# EAGLE design stm32f4stamp-20131027 (EAGLE 6.4)
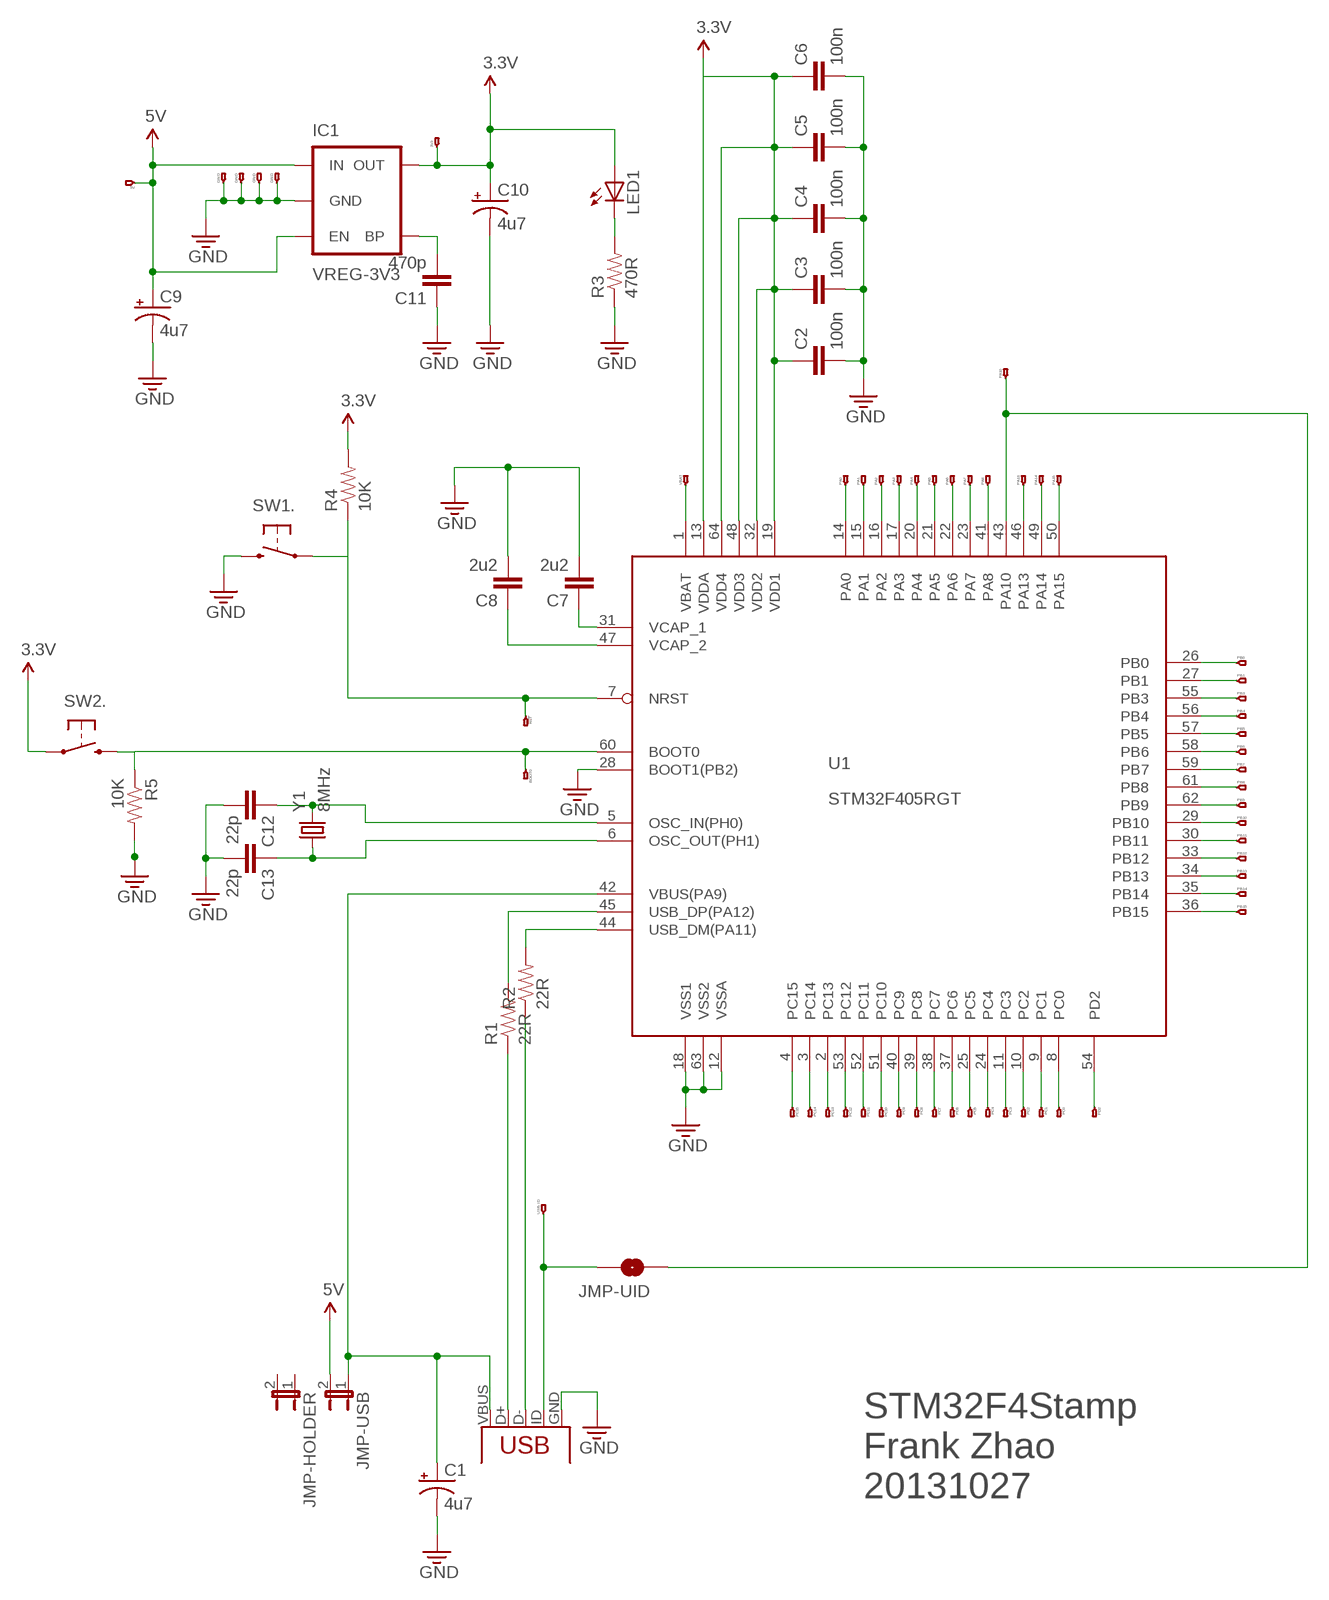
[diagram p0: schematic, sheet 1]

## Parts
C1  4u7  CAP_POL1206-KIT  [EIA3216-KIT]
C2  100n  CAP0603-CAP  [0603-CAP]
C3  100n  CAP0603-CAP  [0603-CAP]
C4  100n  CAP0603-CAP  [0603-CAP]
C5  100n  CAP0603-CAP  [0603-CAP]
C6  100n  CAP0603-CAP  [0603-CAP]
C7  2u2  CAP0603-CAP  [0603-CAP]
C8  2u2  CAP0603-CAP  [0603-CAP]
C9  4u7  CAP_POL1206-KIT  [EIA3216-KIT]
C10  4u7  CAP_POL1206-KIT  [EIA3216-KIT]
C11  470p  CAP0603-CAP  [0603-CAP]
C12  22p  CAP0603-CAP  [0603-CAP]
C13  22p  CAP0603-CAP  [0603-CAP]
IC1  VREG-3V3  V_REG_LDOSMD  [SOT23-5]
JMP-HOLDER  JUMPER-2-PTH-2MM  [1X02_2MM_TH]
JMP-UID  SOLDERJUMPERNC  [SJ_2S]
JMP-USB  JUMPER-2-PTH-2MM  [1X02_2MM_TH]
JP2  5V  HEADERHOLE-HEADERHOLE  [1X1-HEADER-HOLE]
JP3  GND  HEADERHOLE-HEADERHOLE  [1X1-HEADER-HOLE]
JP4  3V3  HEADERHOLE-HEADERHOLE  [1X1-HEADER-HOLE]
JP5  GND  HEADERHOLE-HEADERHOLE  [1X1-HEADER-HOLE]
JP6  GND  HEADERHOLE-HEADERHOLE  [1X1-HEADER-HOLE]
JP7  GND  HEADERHOLE-HEADERHOLE  [1X1-HEADER-HOLE]
JP8  PB8  HEADERHOLE-HEADERHOLE  [1X1-HEADER-HOLE]
JP9  PA10  HEADERHOLE-HEADERHOLE  [1X1-HEADER-HOLE]
JP10  PA8  HEADERHOLE-HEADERHOLE  [1X1-HEADER-HOLE]
JP11  PA13  HEADERHOLE-HEADERHOLE  [1X1-HEADER-HOLE]
JP12  PC9  HEADERHOLE-HEADERHOLE  [1X1-HEADER-HOLE]
JP13  PC15  HEADERHOLE-HEADERHOLE  [1X1-HEADER-HOLE]
JP14  PC14  HEADERHOLE-HEADERHOLE  [1X1-HEADER-HOLE]
JP15  PC13  HEADERHOLE-HEADERHOLE  [1X1-HEADER-HOLE]
JP16  PC12  HEADERHOLE-HEADERHOLE  [1X1-HEADER-HOLE]
JP17  PC11  HEADERHOLE-HEADERHOLE  [1X1-HEADER-HOLE]
JP18  PC10  HEADERHOLE-HEADERHOLE  [1X1-HEADER-HOLE]
JP19  PC8  HEADERHOLE-HEADERHOLE  [1X1-HEADER-HOLE]
JP20  PC7  HEADERHOLE-HEADERHOLE  [1X1-HEADER-HOLE]
JP21  PC6  HEADERHOLE-HEADERHOLE  [1X1-HEADER-HOLE]
JP22  PC5  HEADERHOLE-HEADERHOLE  [1X1-HEADER-HOLE]
JP23  PC4  HEADERHOLE-HEADERHOLE  [1X1-HEADER-HOLE]
JP24  PC3  HEADERHOLE-HEADERHOLE  [1X1-HEADER-HOLE]
JP25  PC2  HEADERHOLE-HEADERHOLE  [1X1-HEADER-HOLE]
JP26  PC1  HEADERHOLE-HEADERHOLE  [1X1-HEADER-HOLE]
JP27  PC0  HEADERHOLE-HEADERHOLE  [1X1-HEADER-HOLE]
JP28  PD2  HEADERHOLE-HEADERHOLE  [1X1-HEADER-HOLE]
JP29  PA0  HEADERHOLE-HEADERHOLE  [1X1-HEADER-HOLE]
JP30  PA1  HEADERHOLE-HEADERHOLE  [1X1-HEADER-HOLE]
JP31  PA2  HEADERHOLE-HEADERHOLE  [1X1-HEADER-HOLE]
JP32  PA3  HEADERHOLE-HEADERHOLE  [1X1-HEADER-HOLE]
JP33  PA4  HEADERHOLE-HEADERHOLE  [1X1-HEADER-HOLE]
JP34  PA5  HEADERHOLE-HEADERHOLE  [1X1-HEADER-HOLE]
JP35  PA6  HEADERHOLE-HEADERHOLE  [1X1-HEADER-HOLE]
JP36  PA7  HEADERHOLE-HEADERHOLE  [1X1-HEADER-HOLE]
JP37  PA14  HEADERHOLE-HEADERHOLE  [1X1-HEADER-HOLE]
JP38  PA15  HEADERHOLE-HEADERHOLE  [1X1-HEADER-HOLE]
JP39  PB0  HEADERHOLE-HEADERHOLE  [1X1-HEADER-HOLE]
JP40  PB1  HEADERHOLE-HEADERHOLE  [1X1-HEADER-HOLE]
JP41  PB3  HEADERHOLE-HEADERHOLE  [1X1-HEADER-HOLE]
JP42  PB4  HEADERHOLE-HEADERHOLE  [1X1-HEADER-HOLE]
JP43  PB5  HEADERHOLE-HEADERHOLE  [1X1-HEADER-HOLE]
JP44  PB6  HEADERHOLE-HEADERHOLE  [1X1-HEADER-HOLE]
JP45  PB7  HEADERHOLE-HEADERHOLE  [1X1-HEADER-HOLE]
JP46  PB9  HEADERHOLE-HEADERHOLE  [1X1-HEADER-HOLE]
JP47  PB10  HEADERHOLE-HEADERHOLE  [1X1-HEADER-HOLE]
JP48  PB11  HEADERHOLE-HEADERHOLE  [1X1-HEADER-HOLE]
JP49  PB12  HEADERHOLE-HEADERHOLE  [1X1-HEADER-HOLE]
JP50  PB13  HEADERHOLE-HEADERHOLE  [1X1-HEADER-HOLE]
JP51  PB14  HEADERHOLE-HEADERHOLE  [1X1-HEADER-HOLE]
JP52  PB15  HEADERHOLE-HEADERHOLE  [1X1-HEADER-HOLE]
JP53  VBAT  HEADERHOLE-HEADERHOLE  [1X1-HEADER-HOLE]
JP54  !RST  HEADERHOLE-HEADERHOLE  [1X1-HEADER-HOLE]
JP55  BOOT0  HEADERHOLE-HEADERHOLE  [1X1-HEADER-HOLE]
JP56  USB-ID  HEADERHOLE-HEADERHOLE  [1X1-HEADER-HOLE]
LED1  LED0603  [LED-0603]
R1  22R  RESISTOR0603-RES  [0603-RES]
R2  22R  RESISTOR0603-RES  [0603-RES]
R3  470R  RESISTOR0603-RES  [0603-RES]
R4  10K  RESISTOR0603-RES  [0603-RES]
R5  10K  RESISTOR0603-RES  [0603-RES]
SW1  !RST  SWITCH-B3U-1110-BOSS  [SWITCH-TACT-B3U-1100P-B]
SW2  BOOT  SWITCH-B3U-1110-BOSS  [SWITCH-TACT-B3U-1100P-B]
U1  STM32F405RGT  [LQFP64]
USB  USB-MICROB-SMD  [USB-MICROB-SMD]
Y1  8MHz  CRYSTAL5X3  [CRYSTAL-SMD-5X3]

## Nets
3.3V: C2.1 C3.1 C4.1 C5.1 C6.1 C10.A(+) IC1.5(OUT) JP4.1 LED1.A R4.2 SW2.1 U1.13(VDDA) U1.19(VDD1) U1.32(VDD2) U1.48(VDD3) U1.64(VDD4)
5V: C9.A(+) IC1.1(IN) IC1.3(EN) JMP-USB.2 JP2.1
GND: C1.C(-) C2.2 C3.2 C4.2 C5.2 C6.2 C7.2 C8.2 C9.C(-) C10.C(-) C11.1 C12.2 C13.2 IC1.2(GND) JP3.1 JP5.1 JP6.1 JP7.1 R3.1 R5.2 SW1.2 SW1.BOSS SW2.BOSS U1.12(VSSA) U1.18(VSS1) U1.28(BOOT1(PB2)) U1.63(VSS2) USB.GND USB.MT1 USB.MT2 USB.MT3 USB.MT4
N$1: R1.2 U1.45(USB_DP(PA12))
N$2: R2.2 U1.44(USB_DM(PA11))
N$3: C1.A(+) JMP-USB.1 U1.42(VBUS(PA9)) USB.VBUS
N$4: JP12.1 U1.40(PC9)
N$5: R1.1 USB.D+
N$6: R2.1 USB.D-
N$7: JP8.1 U1.61(PB8)
N$8: C11.2 IC1.4(BP)
N$10: JP10.1 U1.41(PA8)
N$11: JP11.1 U1.46(PA13)
N$12: C13.1 U1.6(OSC_OUT(PH1)) Y1.1
N$13: C7.1 U1.31(VCAP_1)
N$14: C8.1 U1.47(VCAP_2)
N$15: C12.1 U1.5(OSC_IN(PH0)) Y1.3
N$16: JP55.1 R5.1 SW2.2 U1.60(BOOT0)
N$17: JP54.1 R4.1 SW1.1 U1.7(NRST)
N$18: LED1.C R3.2
N$20: JMP-UID.2 JP56.1 USB.ID
N$22: JMP-UID.1 JP9.1 U1.43(PA10)
N$23: JP13.1 U1.4(PC15)
N$24: JP14.1 U1.3(PC14)
N$25: JP15.1 U1.2(PC13)
N$26: JP16.1 U1.53(PC12)
N$27: JP17.1 U1.52(PC11)
N$28: JP18.1 U1.51(PC10)
N$29: JP19.1 U1.39(PC8)
N$30: JP20.1 U1.38(PC7)
N$31: JP21.1 U1.37(PC6)
N$32: JP22.1 U1.25(PC5)
N$33: JP23.1 U1.24(PC4)
N$34: JP24.1 U1.11(PC3)
N$35: JP25.1 U1.10(PC2)
N$36: JP26.1 U1.9(PC1)
N$37: JP27.1 U1.8(PC0)
N$38: JP28.1 U1.54(PD2)
N$39: JP29.1 U1.14(PA0)
N$40: JP30.1 U1.15(PA1)
N$41: JP31.1 U1.16(PA2)
N$42: JP32.1 U1.17(PA3)
N$43: JP33.1 U1.20(PA4)
N$44: JP34.1 U1.21(PA5)
N$45: JP35.1 U1.22(PA6)
N$46: JP36.1 U1.23(PA7)
N$47: JP37.1 U1.49(PA14)
N$48: JP38.1 U1.50(PA15)
N$49: JP39.1 U1.26(PB0)
N$50: JP40.1 U1.27(PB1)
N$51: JP41.1 U1.55(PB3)
N$52: JP42.1 U1.56(PB4)
N$53: JP43.1 U1.57(PB5)
N$54: JP44.1 U1.58(PB6)
N$55: JP45.1 U1.59(PB7)
N$56: JP46.1 U1.62(PB9)
N$57: JP47.1 U1.29(PB10)
N$58: JP48.1 U1.30(PB11)
N$59: JP49.1 U1.33(PB12)
N$60: JP50.1 U1.34(PB13)
N$61: JP51.1 U1.35(PB14)
N$62: JP52.1 U1.36(PB15)
N$63: JP53.1 U1.1(VBAT)
Unconnected: JMP-HOLDER.1 JMP-HOLDER.2

## Notes on the sheet
- STM32F4Stamp
  Frank Zhao
  20131027

## Library data of the parts
C1 C9 C10 = stm32f4stamp:CAP_POL: Capacitor Polarized These are standard SMD and PTH capacitors. Normally 10uF, 47uF, and 100uF in electrolytic and tantalum varieties. Always verify the external diameter of the through hole cap, it varies with capacity, voltage, and manufacturer. The EIA devices should be standard.
C2-C8 C11-C13 = stm32f4stamp:CAP: Capacitor Standard 0603 ceramic capacitor, and 0.1" leaded capacitor.
IC1 = stm32f4stamp:V_REG_LDO: Voltage Regulator LDO Standard 150mA LDO voltage regulator in SOT-23 layout. Micrel part MIC5205. BP (by-pass) pin is used to lower output noise with 470pF cap.
JMP-HOLDER JMP-USB = stm32f4stamp:JUMPER-2: Jumper Basic 0.1" spaced jumper. Use with breakaway headers.
JMP-UID = stm32f4stamp:SOLDERJUMPER: Solder Jumper Standard SMD solder jumper. Used to automate production. Two varients : Normally Open and Normally Closed are the same, but have different paste layers. NC will have a large amount of paste and should jumper during reflow.
JP2-JP56 = stm32f4stamp:HEADERHOLE
LED1 = stm32f4stamp:LED: LEDs Standard schematic elements and footprints for 5mm, 3mm, 1206, and 0603 sized LEDs. 5mm - Spark Fun Electronics SKU : COM-00529 (and others)
R1-R5 = stm32f4stamp:RESISTOR: Resistor Basic schematic elements and footprints for 0603, 1206, and PTH resistors.
SW1 SW2 = stm32f4stamp:SWITCH-B3U-1110
U1 = stm32f4stamp:STM32F405RGT
USB = stm32f4stamp:USB: USB Connectors USB-B-PTH is fully proven SKU : PRT-00139 USB-miniB is fully proven SKU : PRT-00587 USB-A-PCB is untested. USB-A-H is throughly reviewed, but untested. Spark Fun Electronics SKU : PRT-00437 USB-B-SMT is throughly reviewed, but untested. Needs silkscreen touching up. USB-A-S has not been used/tested USB-MB-H has not been used/tested
Y1 = stm32f4stamp:CRYSTAL: Crystals Various standard crystals. Proven footprints. Spark Fun Electronics SKU : COM-00534

## Board
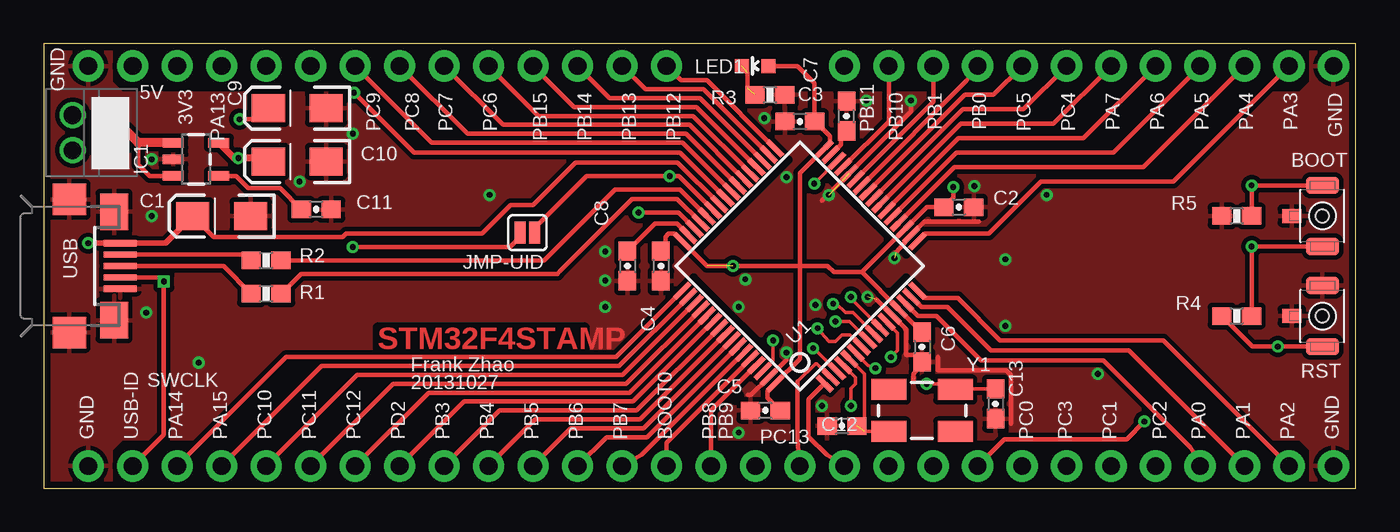
[diagram p1: board, top side]
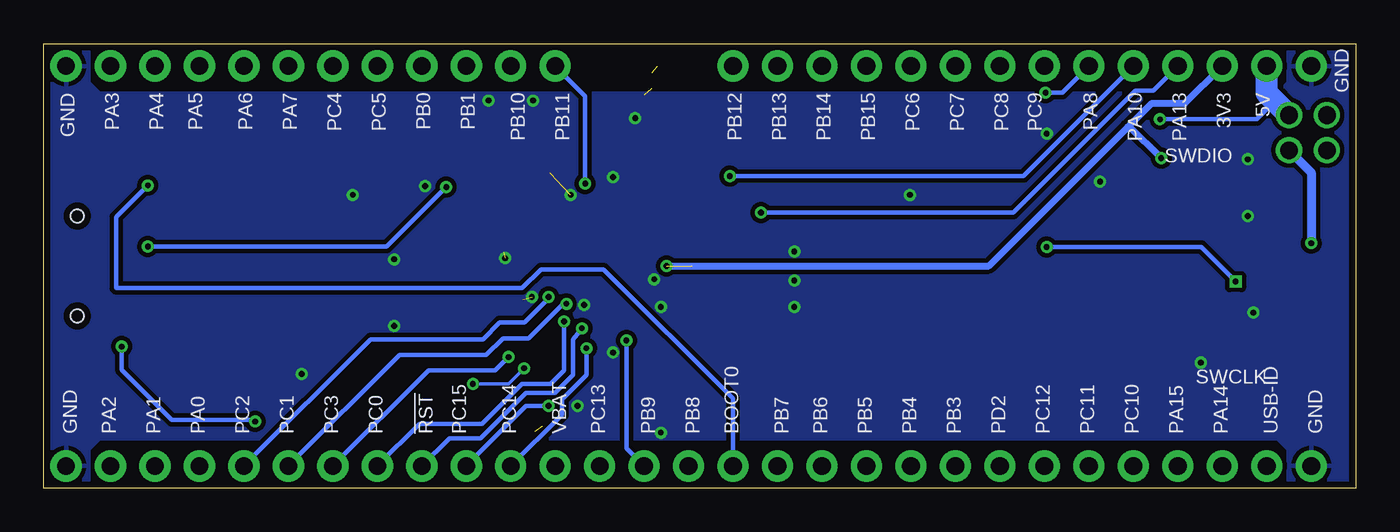
[diagram p2: board, bottom side, seen from below]

Size 74.93 x 25.4 mm. Coordinates in mm from the lower left corner, seen from the top.
Outline: 0,0 74.93,0 74.93,25.4 0,25.4 0,0
Copper layers (1*16): Top 0.0356mm / dielectric 1.5011mm / Bottom 0.0356mm
Design rules "default": minimum track width 6mil, minimum drill 13mil, track to track 6mil, track to pad 6mil, pad to pad 6mil, via to via 6mil, smd to smd 6mil, copper to edge 15mil, drill to drill 6mil, minimum pad ring 7mil, minimum via ring 7mil, stop-mask expansion 2mil, vias tented up to drill 25mil, thermal gap 10mil
tRestrict: 2 lines

### Footprints (pad centres in the part's own frame; a part is rotated, then mirrored left to right if it is on the bottom)
EIA3216-KIT = smd 1.9 x 1.6: A 1.65,0; C -1.65,0
0603-CAP = smd 1.1 x 1: 1 -0.85,0; 2 0.85,0
SOT23-5 = smd 0.55 x 1.2: 1 -0.95,-1.3; 2 0,-1.3; 3 0.95,-1.3; 4 0.95,1.3; 5 -0.95,1.3
1X02_2MM_TH = drill 1: 1 -1,0; 2 1,0
SJ_2S = smd 0.635 x 1.27: 1 -0.412,0; 2 0.412,0
1X1-HEADER-HOLE = drill 1.016 pad 1.778: 1 0,0
LED-0603 = smd 0.8 x 0.8: A 0,-0.75; C 0,0.75
0603-RES = smd 1.1 x 1: 1 -0.85,0; 2 0.85,0
SWITCH-TACT-B3U-1100P-B = smd 1 x 1.9: 1 -1.75,0; 2 1.75,0 | smd 0.8 x 1.1: BOSS 0,1.75 | hole 0.762: 0,0
LQFP64 = smd 0.3 x 1.2: 1 -3.75,-5.75; 2 -3.25,-5.75; 3 -2.75,-5.75; 4 -2.25,-5.75; 5 -1.75,-5.75; 6 -1.25,-5.75; 7 -0.75,-5.75; 8 -0.25,-5.75; 9 0.25,-5.75; 10 0.75,-5.75; 11 1.25,-5.75; 12 1.75,-5.75; 13 2.25,-5.75; 14 2.75,-5.75; 15 3.25,-5.75; 16 3.75,-5.75; 33 3.75,5.75; 34 3.25,5.75; 35 2.75,5.75; 36 2.25,5.75; 37 1.75,5.75; 38 1.25,5.75; 39 0.75,5.75; 40 0.25,5.75; 41 -0.25,5.75; 42 -0.75,5.75; 43 -1.25,5.75; 44 -1.75,5.75; 45 -2.25,5.75; 46 -2.75,5.75; 47 -3.25,5.75; 48 -3.75,5.75 | smd 1.2 x 0.3: 17 5.75,-3.75; 18 5.75,-3.25; 19 5.75,-2.75; 20 5.75,-2.25; 21 5.75,-1.75; 22 5.75,-1.25; 23 5.75,-0.75; 24 5.75,-0.25; 25 5.75,0.25; 26 5.75,0.75; 27 5.75,1.25; 28 5.75,1.75; 29 5.75,2.25; 30 5.75,2.75; 31 5.75,3.25; 32 5.75,3.75; 49 -5.75,3.75; 50 -5.75,3.25; 51 -5.75,2.75; 52 -5.75,2.25; 53 -5.75,1.75; 54 -5.75,1.25; 55 -5.75,0.75; 56 -5.75,0.25; 57 -5.75,-0.25; 58 -5.75,-0.75; 59 -5.75,-1.25; 60 -5.75,-1.75; 61 -5.75,-2.25; 62 -5.75,-2.75; 63 -5.75,-3.25; 64 -5.75,-3.75
USB-MICROB-SMD = smd 0.35 x 1.9: D+ 0,2.9; D- -0.65,2.9; GND 1.3,2.9; ID 0.65,2.9; VBUS -1.3,2.9 | smd 1.8 x 1.9: MT1 -3.8,0; MT2 3.8,0 | smd 2.1 x 1.6: MT3 -3.1,2.55; MT4 3.1,2.55
CRYSTAL-SMD-5X3 = smd 2 x 1.2: 1 -1.9,-1.2; 2 1.9,-1.2; 3 1.9,1.2; 4 -1.9,1.2

### Placement (x,y rotation side)
C1  10.16,15.56 180 top
C2  52.26,16.07 0 top
C3  43.18,20.95 180 top
C4  35.24,12.7 270 top
C5  41.21,4.45 180 top
C6  50.16,8.06 270 top
C7  45.85,21.27 90 top
C8  33.34,12.7 270 top
C9  14.48,21.72 180 top
C10  14.48,18.67 180 top
C11  15.56,15.94 180 top
C12  45.59,3.56 180 top
C13  54.36,4.83 270 top
IC1  8.7,18.8 270 top
JMP-HOLDER  1.65,20.32 90 top
JMP-UID  27.62,14.61 180 top
JMP-USB  3.81,20.32 90 top
JP2  5.08,24.13 0 top
JP3  2.54,24.13 0 top
JP4  7.62,24.13 0 top
JP5  2.54,1.27 0 top
JP6  73.66,1.27 0 top
JP7  73.66,24.13 0 top
JP8  38.1,1.27 0 top
JP9  12.7,24.13 0 top
JP10  15.24,24.13 0 top
JP11  10.16,24.13 0 top
JP12  17.78,24.13 0 top
JP13  50.8,1.27 0 top
JP14  48.26,1.27 0 top
JP15  43.18,1.27 0 top
JP16  17.78,1.27 0 top
JP17  15.24,1.27 0 top
JP18  12.7,1.27 0 top
JP19  20.32,24.13 0 top
JP20  22.86,24.13 0 top
JP21  25.4,24.13 0 top
JP22  55.88,24.13 0 top
JP23  58.42,24.13 0 top
JP24  58.42,1.27 0 top
JP25  63.5,1.27 0 top
JP26  60.96,1.27 0 top
JP27  55.88,1.27 0 top
JP28  20.32,1.27 0 top
JP29  66.04,1.27 0 top
JP30  68.58,1.27 0 top
JP31  71.12,1.27 0 top
JP32  71.12,24.13 0 top
JP33  68.58,24.13 0 top
JP34  66.04,24.13 0 top
JP35  63.5,24.13 0 top
JP36  60.96,24.13 0 top
JP37  7.62,1.27 0 top
JP38  10.16,1.27 0 top
JP39  53.34,24.13 0 top
JP40  50.8,24.13 0 top
JP41  22.86,1.27 0 top
JP42  25.4,1.27 0 top
JP43  27.94,1.27 0 top
JP44  30.48,1.27 0 top
JP45  33.02,1.27 0 top
JP46  40.64,1.27 270 top
JP47  48.26,24.13 270 top
JP48  45.72,24.13 270 top
JP49  35.56,24.13 270 top
JP50  33.02,24.13 270 top
JP51  30.48,24.13 270 top
JP52  27.94,24.13 270 top
JP53  45.72,1.27 0 top
JP54  53.34,1.27 0 top
JP55  35.56,1.27 0 top
JP56  5.08,1.27 0 top
LED1  40.64,24.13 90 top
R1  12.7,11.11 0 top
R2  12.7,13.02 0 top
R3  41.47,22.48 180 top
R4  68.14,9.84 0 top
R5  68.14,15.56 180 top
SW1  73.03,9.84 90 top
SW2  73.03,15.56 90 top
U1  43.18,12.7 45 top
USB  1.46,12.7 270 top
Y1  50.16,4.45 180 top

### Tracks (layer width: path | path; a pad name or v marks a point on that pad's centre or on a via)
3.3V  (via drill 0.33)  (1 unrouted)
  Top 0.254: C6.1 50.16,8.9 U1.13 46.72,12.35 | 43.18,12.7 37.88,12.7 U1.48 36.03,14.54 35.68,14.54 35.5,14.36 35.5,14.03 35.24,13.78 C4.1 | 43.18,12.7 43.18,18 U1.32 44.9,19.72 44.9,20.13 44.07,20.95 C3.1 44.03,23.15 43.05,24.13 LED1.A | 46.72,12.35 U1.19 50.44,16.07 C2.1 51.94,16.6 v51.94,17.21 | 43.18,12.7 43.18,7.4 U1.64 41.34,5.55 41.34,5.17 C5.1 | 46.72,12.35 45.12,12.35 44.77,12.7 43.18,12.7 | SW2.1 v68.99,13.81 R4.2
  Top 0.406: IC1.5 10.89,18.86 v11.11,18.86 12.64,18.86 C10.A
  Bottom 0.254: v51.94,17.21 55.34,13.81 v68.99,13.81
  Bottom 0.406: v39.37,12.7 20.95,12.7 13.02,20.64 | 13.02,20.64 11.68,21.97 9.78,21.97 JP4.1 | v11.11,18.86 12.89,20.64 13.02,20.64
5V  (via drill 0.33)
  Top 0.254: v11.18,21.08 13.02,21.08 C9.A | IC1.3 6.04,17.85 5.4,18.49 5.4,19.75
  Top 0.508: IC1.1 5.4,19.75 5.38,19.75 JMP-USB.2
  Bottom 0.254: v11.18,21.08 5.65,21.08 4.61,22.12
  Bottom 1.27: JMP-USB.2 4.61,22.12 5.08,22.59 JP2.1
GND  (via drill 0.33)  (3 unrouted)
  Top 0.203: 44.45,16.45 v44.83,16.76
  Top 0.254: 42.42,7.34 U1.63 40.4,5.32 40.22,5.32 | 47.56,10.79 U1.12 49.24,9.11 49.24,7.65 49.28,7.62 49.78,7.62 | 48.66,13.46 U1.18 50.31,15.23 53.42,15.23 | 55.24,3.68 55.24,6.48 54.99,6.73 51.05,6.73 51.05,7.49 | 44.45,16.45 49.53,21.52 v49.53,22.16 | 49.85,6.73 49.66,6.54 49.66,6.16
  other vias: 42.42,17.78 40.07,11.94 42.42,7.75 48.58,13.14 47.05,10.92 6.16,18.8 17.65,20.26 14.61,17.53 44.45,4.7 53.15,17.27 60.2,6.54 32.07,11.87 41.15,21.15 46.99,22.16 54.93,9.27 44.07,10.48 54.93,13.08 5.84,10.03 32.07,13.53 39.69,3.17 32.07,10.35 39.69,10.35 8.84,7.18 25.46,16.76 57.28,16.76 6.16,15.56
  pour Bottom (isolate 0.254): 0,25.4 3.81,25.4 3.81,23.18 4.45,22.54 71.75,22.54 72.39,23.18 72.39,25.4 74.93,25.4 74.93,0 72.39,0 72.39,2.22 71.75,2.86 4.45,2.86 3.81,2.22 3.81,0 0,0
  pour Top (isolate 0.254): 0,25.4 3.81,25.4 3.81,23.18 4.45,22.54 71.75,22.54 72.39,23.18 72.39,25.4 74.93,25.4 74.93,0 72.39,0 72.39,2.22 71.75,2.86 4.45,2.86 3.81,2.22 3.81,0 0,0
N$1
  Top 0.254: U1.45 36.17,16.53 33.61,16.53 29.46,12.38 29.34,12.26 14.69,12.26 R1.2
N$2
  Top 0.254: U1.44 36.34,17.07 32.63,17.07 28.89,13.34 28.57,13.02 R2.2
N$3  (via drill 0.33)
  Top 0.254: U1.42 36.2,18.62 30.36,18.62 27.94,16.19 26.67,16.19 25.02,14.54 17.27,14.54 17.08,14.35 9.72,14.35 C1.A
  Top 0.305: C1.A 6.95,14 USB.VBUS v2.54,14
  Bottom 0.508: JMP-USB.1 2.54,18.05 v2.54,14
N$4
  Top 0.254: U1.40 36.48,19.75 22.16,19.75 JP12.1
N$5
  Top 0.254: USB.D+ 10.26,12.7 R1.1
N$6
  Top 0.254: USB.D- 11.84,13.35 R2.1
N$7
  Top 0.254: U1.61 38.1,4.44 JP8.1
N$8
  Top 0.254: IC1.4 10.98,17.85 11.68,17.14 13.5,17.14 C11.2
N$10  (via drill 0.33)
  Top 0.254: U1.41 36.35,19.18 21.14,19.18 v17.72,22.61
  Bottom 0.254: v17.72,22.61 16.76,22.61 JP10.1
N$11  (via drill 0.33)
  Top 0.254: U1.46 36.24,15.75 v33.97,15.75
  Bottom 0.254: JP11.1 11.56,22.73 12.57,22.73 19.56,15.75 v33.97,15.75
N$12  (via drill 0.33)
  Top 0.203: U1.6 47.08,7.03 v47.5,6.86 | v50.42,5.97 52.06,5.97 Y1.1 52.06,5.68 C13.1
  Bottom 0.203: v47.5,6.86 48.39,5.97 v50.42,5.97
N$13
  Top 0.254: U1.31 45.53,19.65 45.53,20 45.85,20.32 C7.1
N$14
  Top 0.254: U1.47 36.17,15.11 34.9,15.11 C8.1
N$15  (1 unrouted)
  Top 0.203: U1.5 46.86,6.54 46.86,3.25 Y1.3 47.72,3.25
N$16  (via drill 0.33)
  Top 0.254: U1.60 35.56,2.6 JP55.1 | SW2.2 v68.99,17.31 R5.1
  Bottom 0.254: JP55.1 35.56,5.13 42.95,12.51 46.54,12.51 47.62,11.43 70.8,11.43 70.8,15.49 v68.99,17.31
N$17  (via drill 0.33)
  Top 0.203: U1.7 46.06,8.76 45.59,8.76 45.21,8.38 44.83,8.38 v44.2,9.14
  Top 0.254: JP54.1 54.86,2.79 61.85,2.79 v62.87,3.81 | R4.1 69.03,8.09 v70.48,8.09 SW1.1
  Bottom 0.254: JP54.1 51.75,2.86 49.97,2.86 47.37,5.46 45.72,5.46 44.7,6.48 44.7,8.51 v44.2,9.14 | v62.87,3.81 62.99,3.91 67.63,3.91 70.48,6.77 v70.48,8.09
N$18  (2 unrouted)
  Top 0.254: 40.2,23.75 40.2,22.86
N$20  (via drill 0.33)
  Top 0.254: USB.ID 6.62,12.05 v6.86,11.81 6.86,3.05 JP56.1 | v17.65,13.78 26.64,13.78 27.21,14.35 JMP-UID.2
  Bottom 0.254: v17.65,13.78 8.83,13.78 v6.86,11.81
N$22  (via drill 0.33)
  Top 0.254: U1.43 36.27,17.84 v35.75,17.84 31,17.84 28.03,14.87 JMP-UID.1
  Bottom 0.254: v35.75,17.84 18.99,17.84 JP9.1
N$23  (via drill 0.33)
  Top 0.203: U1.4 46.35,6.34 46.35,5.97 46.1,5.71 v46.1,4.7
  Bottom 0.254: JP13.1 47.37,4.7 v46.1,4.7
N$24  (via drill 0.33)
  Top 0.203: U1.3 43.99,8
  Top 0.254: 43.99,8 v43.94,8
  Bottom 0.254: JP14.1 45.34,4.19 45.34,5.08 43.94,6.48 v43.94,8
N$25
  Top 0.203: U1.2 44.17,7.11 44.07,7.11 43.05,6.1
  Top 0.254: 43.05,6.1 43.05,2.67 JP15.1
N$26
  Top 0.254: U1.53 33.47,5.46 21.97,5.46 JP16.1
N$27
  Top 0.254: U1.52 33.27,5.97 19.94,5.97 JP17.1
N$28
  Top 0.254: U1.51 33.07,6.48 17.91,6.48 JP18.1
N$29
  Top 0.254: U1.39 36.68,20.26 24.19,20.26 JP19.1
N$30
  Top 0.254: U1.38 36.88,20.77 26.23,20.77 JP20.1
N$31
  Top 0.254: U1.37 37.08,21.27 28.26,21.27 JP21.1
N$32
  Top 0.254: U1.25 52.6,22.48 54.23,22.48 JP22.1
N$33
  Top 0.254: U1.24 52.49,21.65 55.94,21.65 JP23.1
N$34  (via drill 0.33)
  Top 0.203: U1.11 48.77,8.88 48.77,7.87 v48.39,7.49
  Bottom 0.254: JP24.1 52.96,6.73 49.15,6.73 v48.39,7.49
N$35  (via drill 0.33)
  Top 0.203: U1.10 46.1,10.84
  Top 0.254: 46.1,10.84 v46.1,10.92
  Bottom 0.254: JP25.1 56.26,8.51 49.85,8.51 48.9,9.46 47.48,9.46 46.1,10.84 v46.1,10.92
N$36  (via drill 0.33)
  Top 0.203: U1.9 46.2,10.03 45.78,10.03 45.28,10.54
  Top 0.254: 45.28,10.54 v45.09,10.54
  Bottom 0.254: JP26.1 54.61,7.62 49.66,7.62 48.7,8.57 47.24,8.57 45.28,10.54 v45.09,10.54
N$37  (via drill 0.33)
  Top 0.203: U1.8 46,9.53 v45.21,9.53
  Bottom 0.254: JP27.1 53.47,3.68 49.91,3.68 47.62,5.97 45.97,5.97 45.21,6.73 v45.21,9.53
N$38
  Top 0.254: U1.54 33.66,4.95 24,4.95 JP28.1
N$39
  Top 0.254: U1.14 49.93,9.84 50.99,9.84 53.53,7.3 60.51,7.3 65.48,2.33 65.8,1.84 JP29.1
N$40
  Top 0.254: U1.15 50.13,10.35 51.61,10.35 54.09,7.87 61.98,7.87 JP30.1
N$41
  Top 0.254: U1.16 50.33,10.86 52.2,10.86 54.61,8.45 63.94,8.45 JP31.1
N$42
  Top 0.254: U1.17 50.33,14.54 53.98,14.54 56.96,17.53 64.52,17.53 JP32.1
N$43
  Top 0.254: U1.20 52.01,18.35 62.8,18.35 JP33.1
N$44
  Top 0.254: U1.21 52.13,19.18 61.09,19.18 JP34.1
N$45
  Top 0.254: U1.22 52.25,20 59.37,20 JP35.1
N$46
  Top 0.254: U1.23 52.37,20.83 57.66,20.83 JP36.1
N$47
  Top 0.254: U1.49 32.67,7.49 13.84,7.49 JP37.1
N$48
  Top 0.254: U1.50 32.87,6.99 15.88,6.99 JP38.1
N$49
  Top 0.254: U1.26 52.7,23.29 JP39.1
N$50
  Top 0.254: U1.27 50.8,22.09 JP40.1
N$51
  Top 0.254: U1.55 33.86,4.45 26.04,4.45 JP41.1
N$52
  Top 0.254: U1.56 34.06,3.94 28.07,3.94 JP42.1
N$53
  Top 0.254: U1.57 34.26,3.43 30.1,3.43 JP43.1
N$54
  Top 0.254: U1.58 34.46,2.92 32.13,2.92 JP44.1
N$55
  Top 0.254: U1.59 34.15,1.91 JP45.1
N$56  (via drill 0.33)
  Top 0.203: U1.62 41.66,7.29 v41.66,8.45
  Bottom 0.254: JP46.1 41.66,2.29 v41.66,8.45
N$57
  Top 0.254: U1.29 48.26,20.96 JP47.1
N$58  (via drill 0.33)
  Top 0.203: U1.30 v44.01,17.41
  Bottom 0.254: v44.01,17.41 44.01,22.42 JP48.1
N$59
  Top 0.254: U1.33 37.88,23.3 36.39,23.3 JP49.1
N$60
  Top 0.254: U1.34 37.68,22.8 34.35,22.8 JP50.1
N$61
  Top 0.254: U1.35 37.48,22.29 32.32,22.29 JP51.1
N$62
  Top 0.254: U1.36 37.28,21.78 30.29,21.78 JP52.1
N$63
  Top 0.254: U1.1 43.69,5.08 43.69,2.94 44.73,1.91 JP53.1

### Text on the board
Top: STM32F4STAMP
tStop: STM32F4STAMP
_tsilk: BOOT | Frank Zhao | RST | SWCLK | 20131027
_bsilk: SWDIO | SWCLK